# Altium schematic sheet Sheet4.SchDoc
size A4
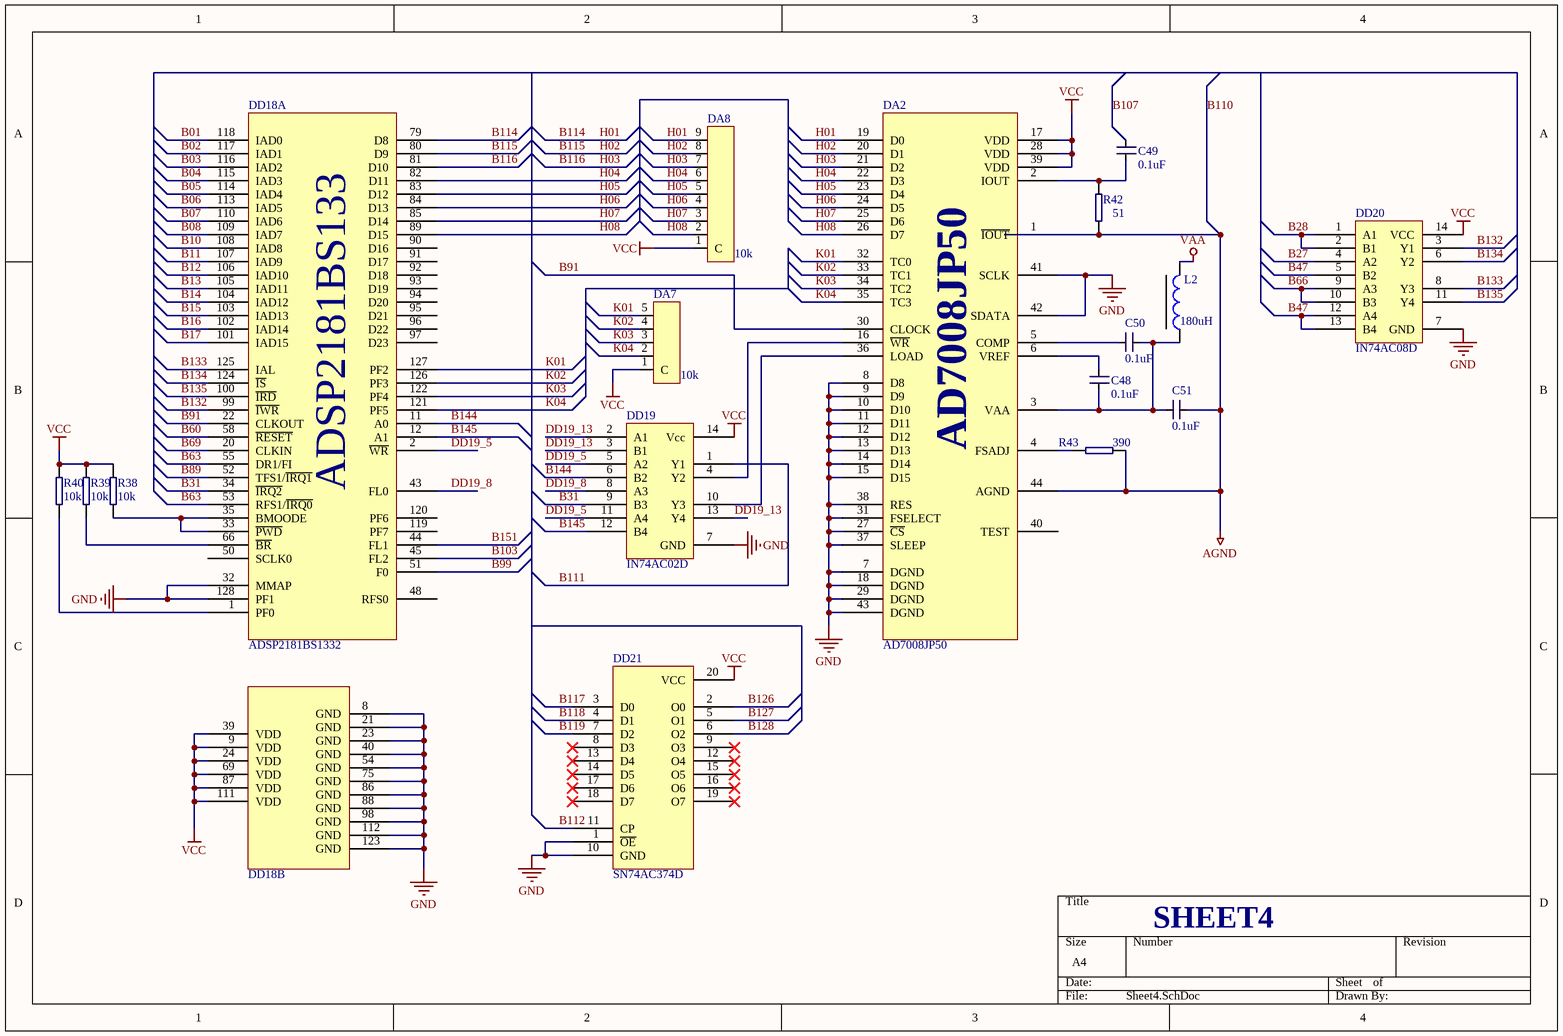
[diagram p0: Sheet4.SchDoc]

## Parts
C48  value 0.1uF  [0805]  (hidden comment: Cap)
C49  value 0.1uF  [0805]  (hidden comment: Cap)
C50  value 0.1uF  [0805]  (hidden comment: Cap)
C51  value 0.1uF  [0805]  (hidden comment: Cap)
DA2  AD7008JP50  [44 PLCC]
DA7  value 10k  [5 SIP]  (hidden comment: 5A103J)
DA8  value 10k  [9 SIP]  (hidden comment: 9A103J)
DD18  ADSP2181BS1332  [128 PQFP]  (parts A,B of 2)
DD19  IN74AC02D  [14 SOIC-3.9]
DD20  IN74AC08D  [14 TSSOP-4.4]
DD21  SN74AC374D  [20 SOIC-7.5]
L2  value 180uH  [E(1820)]  (hidden comment: L)
R38  value 10k  [0805]  (hidden comment: R)
R39  value 10k  [0805]  (hidden comment: R)
R40  value 10k  [0805]  (hidden comment: R)
R42  value 51  [0805]  (hidden comment: R)
R43  value 390  [0805]  (hidden comment: R)

## Nets
B110: C51.1 DA2.1(~{IOUT}) DA2.44(AGND) R42.1 R43.2  [also labelled AGND]
GND: DA2.7(DGND) DA2.8(D8) DA2.9(D9) DA2.10(D10) DA2.11(D11) DA2.12(D12) DA2.13(D13) DA2.14(D14) DA2.15(D15) DA2.18(DGND) DA2.27(~{CS}) DA2.29(DGND) DA2.31(FSELECT) DA2.37(SLEEP) DA2.38(RES) DA2.41(SCLK) DA2.42(SDATA) DA2.43(DGND) DD18.8(GND) DD18.21(GND) DD18.23(GND) DD18.32(MMAP) DD18.40(GND) DD18.54(GND) DD18.75(GND) DD18.86(GND) DD18.88(GND) DD18.98(GND) DD18.112(GND) DD18.123(GND) DD18.128(PF1) DD19.7(GND) DD20.7(GND) DD21.1(~{OE}) DD21.10(GND)
VAA: L2.2
VCC: DA2.17(VDD) DA2.28(VDD) DA2.39(VDD) DA7.1(C) DA8.1(C) DD18.9(VDD) DD18.24(VDD) DD18.39(VDD) DD18.69(VDD) DD18.87(VDD) DD18.111(VDD) DD19.14(Vcc) DD20.14(VCC) DD21.20(VCC) R38.2 R39.2 R40.2
B01: DD18.118(IAD0)
B02: DD18.117(IAD1)
B03: DD18.116(IAD2)
B04: DD18.115(IAD3)
B05: DD18.114(IAD4)
B06: DD18.113(IAD5)
B07: DD18.110(IAD6)
B08: DD18.109(IAD7)
B10: DD18.108(IAD8)
B11: DD18.107(IAD9)
B12: DD18.106(IAD10)
B13: DD18.105(IAD11)
B14: DD18.104(IAD12)
B15: DD18.103(IAD13)
B16: DD18.102(IAD14)
B17: DD18.101(IAD15)
B27: DD20.4(A2)
B28: DD20.1(A1) DD20.2(B1)
B31: DD18.34(~{IRQ2}) DD19.9(B3)
B47: DD20.5(B2) DD20.12(A4) DD20.13(B4)
B60: DD18.58(~{RESET})
B63: DD18.53(RFS1/~{IRQ0}) DD18.55(DR1/FI)
B66: DD20.9(A3) DD20.10(B3)
B69: DD18.20(CLKIN)
B89: DD18.52(TFS1/~{IRQ1})
B91: DA2.30(CLOCK) DD18.22(CLKOUT)
B99: DD18.51(F0)
B103: DD18.45(FL2)
B107: C49.2
B111: DD19.1(Y1)
B112: DD21.11(CP)
B114: DA2.19(D0) DA8.9 DD18.79(D8)  [also labelled H01]
B115: DA2.20(D1) DA8.8 DD18.80(D9)  [also labelled H02]
B116: DA2.21(D2) DA8.7 DD18.81(D10)  [also labelled H03]
B117: DD21.3(D0)
B118: DD21.4(D1)
B119: DD21.7(D2)
B126: DD21.2(O0)
B127: DD21.5(O1)
B128: DD21.6(O2)
B132: DD18.99(~{IWR}) DD20.3(Y1)
B133: DD18.125(IAL) DD20.8(Y3)
B134: DD18.124(~{IS}) DD20.6(Y2)
B135: DD18.100(~{IRD}) DD20.11(Y4)
B144: DD18.11(A0) DD19.6(B2)
B145: DD18.12(A1) DD19.12(B4)
B151: DD18.44(FL1)
DD19_5: DD18.2(~{WR}) DD19.5(A2) DD19.11(A4)
DD19_8: DD18.43(FL0) DD19.8(A3)
DD19_13: DD19.2(A1) DD19.3(B1) DD19.13(Y4)
H04: DA2.22(D3) DA8.6 DD18.82(D11)
H05: DA2.23(D4) DA8.5 DD18.83(D12)
H06: DA2.24(D5) DA8.4 DD18.84(D13)
H07: DA2.25(D6) DA8.3 DD18.85(D14)
H08: DA2.26(D7) DA8.2 DD18.89(D15)
K01: DA2.32(TC0) DA7.5 DD18.127(PF2)
K02: DA2.33(TC1) DA7.4 DD18.126(PF3)
K03: DA2.34(TC2) DA7.3 DD18.122(PF4)
K04: DA2.35(TC3) DA7.2 DD18.121(PF5)
NetC48_1: C48.1 C50.1 C51.2 DA2.3(VAA) L2.1
NetC48_2: C48.2 DA2.6(VREF)
NetC49_1: C49.1 DA2.2(IOUT) R42.2
NetC50_2: C50.2 DA2.5(COMP)
NetDA2_4: DA2.4(FSADJ) R43.1
NetDA2_16: DA2.16(~{WR}) DD19.4(Y2)
NetDA2_36: DA2.36(LOAD) DD19.10(Y3)
NetDD18_1: DD18.1(PF0) R40.1
NetDD18_33: DD18.33(~{PWD}) DD18.35(BMOODE) R38.1
NetDD18_66: DD18.66(~{BR}) R39.1

Not connected (* = marked no-connect by the designer): DA2 40(TEST); DD18 48(RFS0) 50(SCLK0) 90(D16) 91(D17) 92(D18) 93(D19) 94(D20) 95(D21) 96(D22) 97(D23) 119(PF7) 120(PF6); DD21 8(D3)* 9(O3)* 12(O4)* 13(D4)* 14(D5)* 15(O5)* 16(O6)* 17(D6)* 18(D7)* 19(O7)*

## Notes on the sheet
- SHEET4
- (in symbol ADSP2181BS1332, part A) ADSP2181BS133